# EAGLE design led_board (EAGLE 9.6.2)
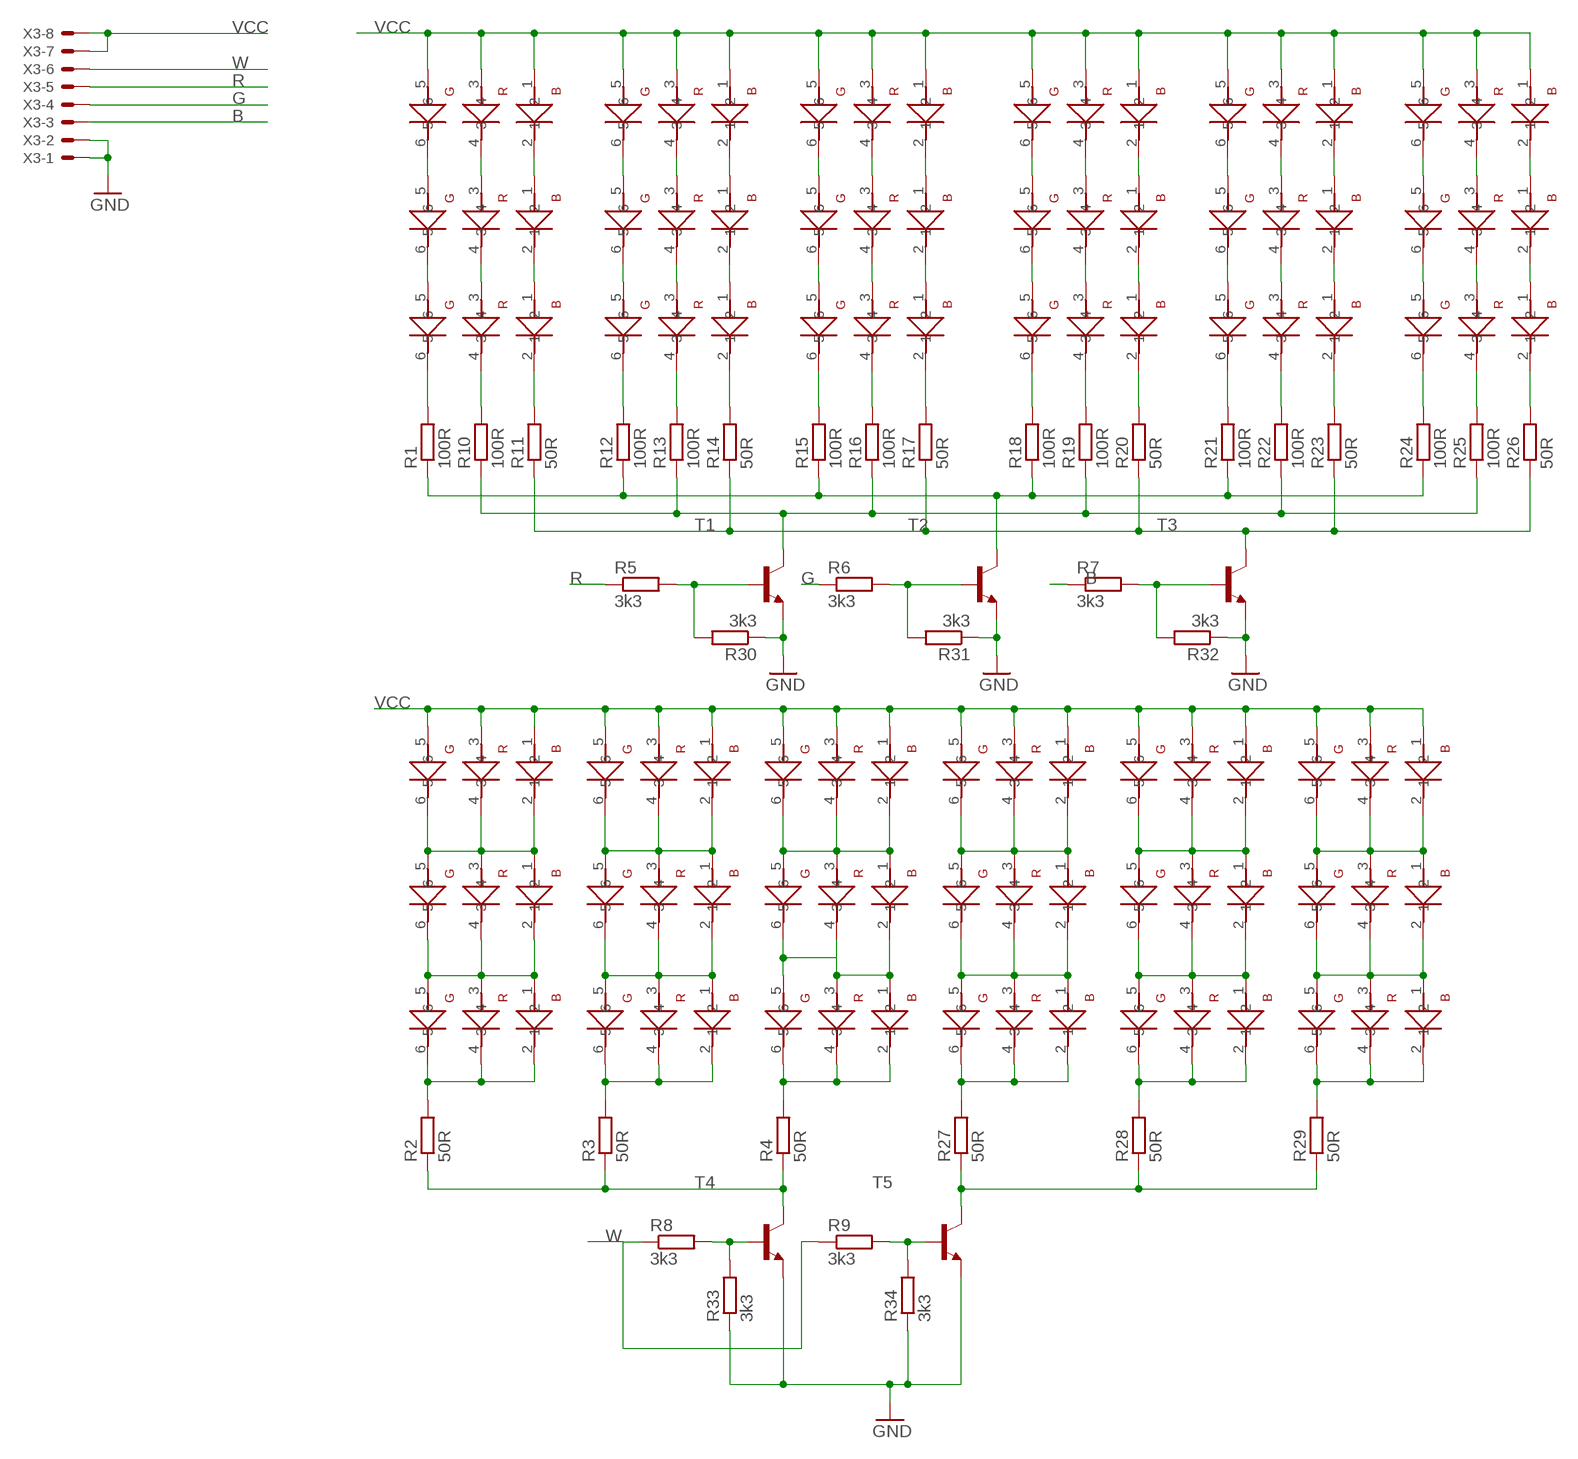
[diagram p0: schematic, sheet 1]

## Parts
R1  100R  R-EU_M1206  [M1206]
R2  50R  R-EU_M1206  [M1206]
R3  50R  R-EU_M1206  [M1206]
R4  50R  R-EU_M1206  [M1206]
R5  3k3  R-EU_M1206  [M1206]
R6  3k3  R-EU_M1206  [M1206]
R7  3k3  R-EU_M1206  [M1206]
R8  3k3  R-EU_M1206  [M1206]
R9  3k3  R-EU_M1206  [M1206]
R10  100R  R-EU_M1206  [M1206]
R11  50R  R-EU_M1206  [M1206]
R12  100R  R-EU_M1206  [M1206]
R13  100R  R-EU_M1206  [M1206]
R14  50R  R-EU_M1206  [M1206]
R15  100R  R-EU_M1206  [M1206]
R16  100R  R-EU_M1206  [M1206]
R17  50R  R-EU_M1206  [M1206]
R18  100R  R-EU_M1206  [M1206]
R19  100R  R-EU_M1206  [M1206]
R20  50R  R-EU_M1206  [M1206]
R21  100R  R-EU_M1206  [M1206]
R22  100R  R-EU_M1206  [M1206]
R23  50R  R-EU_M1206  [M1206]
R24  100R  R-EU_M1206  [M1206]
R25  100R  R-EU_M1206  [M1206]
R26  50R  R-EU_M1206  [M1206]
R27  50R  R-EU_M1206  [M1206]
R28  50R  R-EU_M1206  [M1206]
R29  50R  R-EU_M1206  [M1206]
R30  3k3  R-EU_M1206  [M1206]
R31  3k3  R-EU_M1206  [M1206]
R32  3k3  R-EU_M1206  [M1206]
R33  3k3  R-EU_M1206  [M1206]
R34  3k3  R-EU_M1206  [M1206]
T1  -NPN-SOT223  [SOT223]
T2  -NPN-SOT223  [SOT223]
T3  -NPN-SOT223  [SOT223]
T4  -NPN-SOT223  [SOT223]
T5  -NPN-SOT223  [SOT223]
U$1  5050_LED  [5050_LED]
U$2  5050_LED  [5050_LED]
U$3  5050_LED  [5050_LED]
U$4  5050_LED  [5050_LED]
U$5  5050_LED  [5050_LED]
U$6  5050_LED  [5050_LED]
U$7  5050_LED  [5050_LED]
U$8  5050_LED  [5050_LED]
U$9  5050_LED  [5050_LED]
U$10  5050_LED  [5050_LED]
U$11  5050_LED  [5050_LED]
U$12  5050_LED  [5050_LED]
U$13  5050_LED  [5050_LED]
U$14  5050_LED  [5050_LED]
U$15  5050_LED  [5050_LED]
U$16  5050_LED  [5050_LED]
U$17  5050_LED  [5050_LED]
U$18  5050_LED  [5050_LED]
U$19  5050_LED  [5050_LED]
U$20  5050_LED  [5050_LED]
U$21  5050_LED  [5050_LED]
U$22  5050_LED  [5050_LED]
U$23  5050_LED  [5050_LED]
U$24  5050_LED  [5050_LED]
U$25  5050_LED  [5050_LED]
U$26  5050_LED  [5050_LED]
U$27  5050_LED  [5050_LED]
U$28  5050_LED  [5050_LED]
U$29  5050_LED  [5050_LED]
U$30  5050_LED  [5050_LED]
U$31  5050_LED  [5050_LED]
U$32  5050_LED  [5050_LED]
U$33  5050_LED  [5050_LED]
U$34  5050_LED  [5050_LED]
U$35  5050_LED  [5050_LED]
U$38  5050_LED  [5050_LED]
X3  KK-156-8  [KK-156-8]

## Nets
B: R7.1 X3.3
G: R6.1 X3.4
GND: R30.1 R31.1 R32.1 R33.1 R34.1 T1.3(E) T2.3(E) T3.3(E) T4.3(E) T5.3(E) X3.1 X3.2
N$1: R6.2 R31.2 T2.1(B)
N$3: R7.2 R32.2 T3.1(B)
N$4: R11.1 R14.1 R17.1 R20.1 R23.1 R26.1 T3.4(C)
N$5: U$34.2 U$38.1
N$6: R1.1 R12.1 R15.1 R18.1 R21.1 R24.1 T2.4(C)
N$7: U$34.4 U$38.3
N$8: R10.1 R13.1 R16.1 R19.1 R22.1 R25.1 T1.4(C)
N$9: U$34.6 U$38.5
N$10: U$1.1 U$38.2
N$12: R5.2 R30.2 T1.1(B)
N$14: R8.2 R33.2 T4.1(B)
N$15: R9.2 R34.2 T5.1(B)
N$17: U$1.3 U$38.4
N$18: U$1.5 U$38.6
N$19: U$2.2 U$3.1
N$20: U$2.4 U$3.3
N$21: U$2.6 U$3.5
N$22: U$3.2 U$4.1
N$23: U$3.4 U$4.3
N$24: U$3.6 U$4.5
N$25: U$5.2 U$6.1
N$26: U$5.4 U$6.3
N$27: U$5.6 U$6.5
N$28: U$6.2 U$7.1
N$29: U$6.4 U$7.3
N$30: U$6.6 U$7.5
N$31: U$8.2 U$9.1
N$32: U$8.4 U$9.3
N$33: U$8.6 U$9.5
N$34: U$9.2 U$10.1
N$35: U$9.4 U$10.3
N$36: U$9.6 U$10.5
N$37: U$11.2 U$12.1
N$38: U$11.4 U$12.3
N$39: U$11.6 U$12.5
N$40: U$12.2 U$13.1
N$41: U$12.4 U$13.3
N$42: U$12.6 U$13.5
N$43: U$14.2 U$15.1
N$44: U$14.4 U$15.3
N$45: U$14.6 U$15.5
N$46: U$15.2 U$16.1
N$47: U$15.4 U$16.3
N$48: U$15.6 U$16.5
N$50: R1.2 U$1.6
N$51: R10.2 U$1.4
N$52: R11.2 U$1.2
N$53: R12.2 U$4.6
N$54: R13.2 U$4.4
N$55: R15.2 U$7.6
N$56: R16.2 U$7.4
N$57: R17.2 U$7.2
N$58: R18.2 U$10.6
N$59: R19.2 U$10.4
N$60: R21.2 U$13.6
N$61: R22.2 U$13.4
N$62: R23.2 U$13.2
N$63: R24.2 U$16.6
N$64: R26.2 U$16.2
N$65: R25.2 U$16.4
N$66: R20.2 U$10.2
N$67: R14.2 U$4.2
N$68: U$17.2 U$17.4 U$17.6 U$23.1 U$23.3 U$23.5
N$70: U$18.2 U$18.4 U$18.6 U$24.1 U$24.3 U$24.5
N$75: U$19.2 U$19.4 U$19.6 U$25.1 U$25.3 U$25.5
N$78: U$20.2 U$20.4 U$20.6 U$26.1 U$26.3 U$26.5
N$79: U$21.2 U$21.4 U$21.6 U$27.1 U$27.3 U$27.5
N$84: U$22.2 U$22.4 U$22.6 U$28.1 U$28.3 U$28.5
N$87: U$23.2 U$23.4 U$23.6 U$29.1 U$29.3 U$29.5
N$90: U$24.2 U$24.4 U$24.6 U$30.1 U$30.3 U$30.5
N$91: U$25.2 U$25.4 U$25.6 U$31.1 U$31.3 U$31.5
N$94: U$26.2 U$26.4 U$26.6 U$32.1 U$32.3 U$32.5
N$99: U$27.2 U$27.4 U$27.6 U$33.1 U$33.3 U$33.5
N$100: U$28.2 U$28.4 U$28.6 U$35.1 U$35.3 U$35.5
N$104: R2.2 U$29.2 U$29.4 U$29.6
N$105: R29.2 U$35.2 U$35.4 U$35.6
N$106: R28.2 U$33.2 U$33.4 U$33.6
N$107: R27.2 U$32.2 U$32.4 U$32.6
N$108: R4.2 U$31.2 U$31.4 U$31.6
N$109: R3.2 U$30.2 U$30.4 U$30.6
N$111: R27.1 R28.1 R29.1 T5.4(C)
N$112: R2.1 R3.1 R4.1 T4.4(C)
R: R5.1 X3.5
VCC: U$2.1 U$2.3 U$2.5 U$5.1 U$5.3 U$5.5 U$8.1 U$8.3 U$8.5 U$11.1 U$11.3 U$11.5 U$14.1 U$14.3 U$14.5 U$17.1 U$17.3 U$17.5 U$18.1 U$18.3 U$18.5 U$19.1 U$19.3 U$19.5 U$20.1 U$20.3 U$20.5 U$21.1 U$21.3 U$21.5 U$22.1 U$22.3 U$22.5 U$34.1 U$34.3 U$34.5 X3.7 X3.8
W: R8.1 R9.1 X3.6

## Library data of the parts
R1-R34 = rcl:R-EU_: RESISTOR, European symbol; SPICEPREFIX: R
T1-T5 = transistor-neu-to92:*-NPN-: NPN Transistror
U$1-U$35 U$38 = leds:5050_LED
X3 = con-molex:KK-156-8: KK 156 HEADER Source: http://www.molex.com/pdm_docs/sd/026604100_sd.pdf; MF: MOLEX; OC_FARNELL: unknown; OC_NEWARK: unknown

## Board
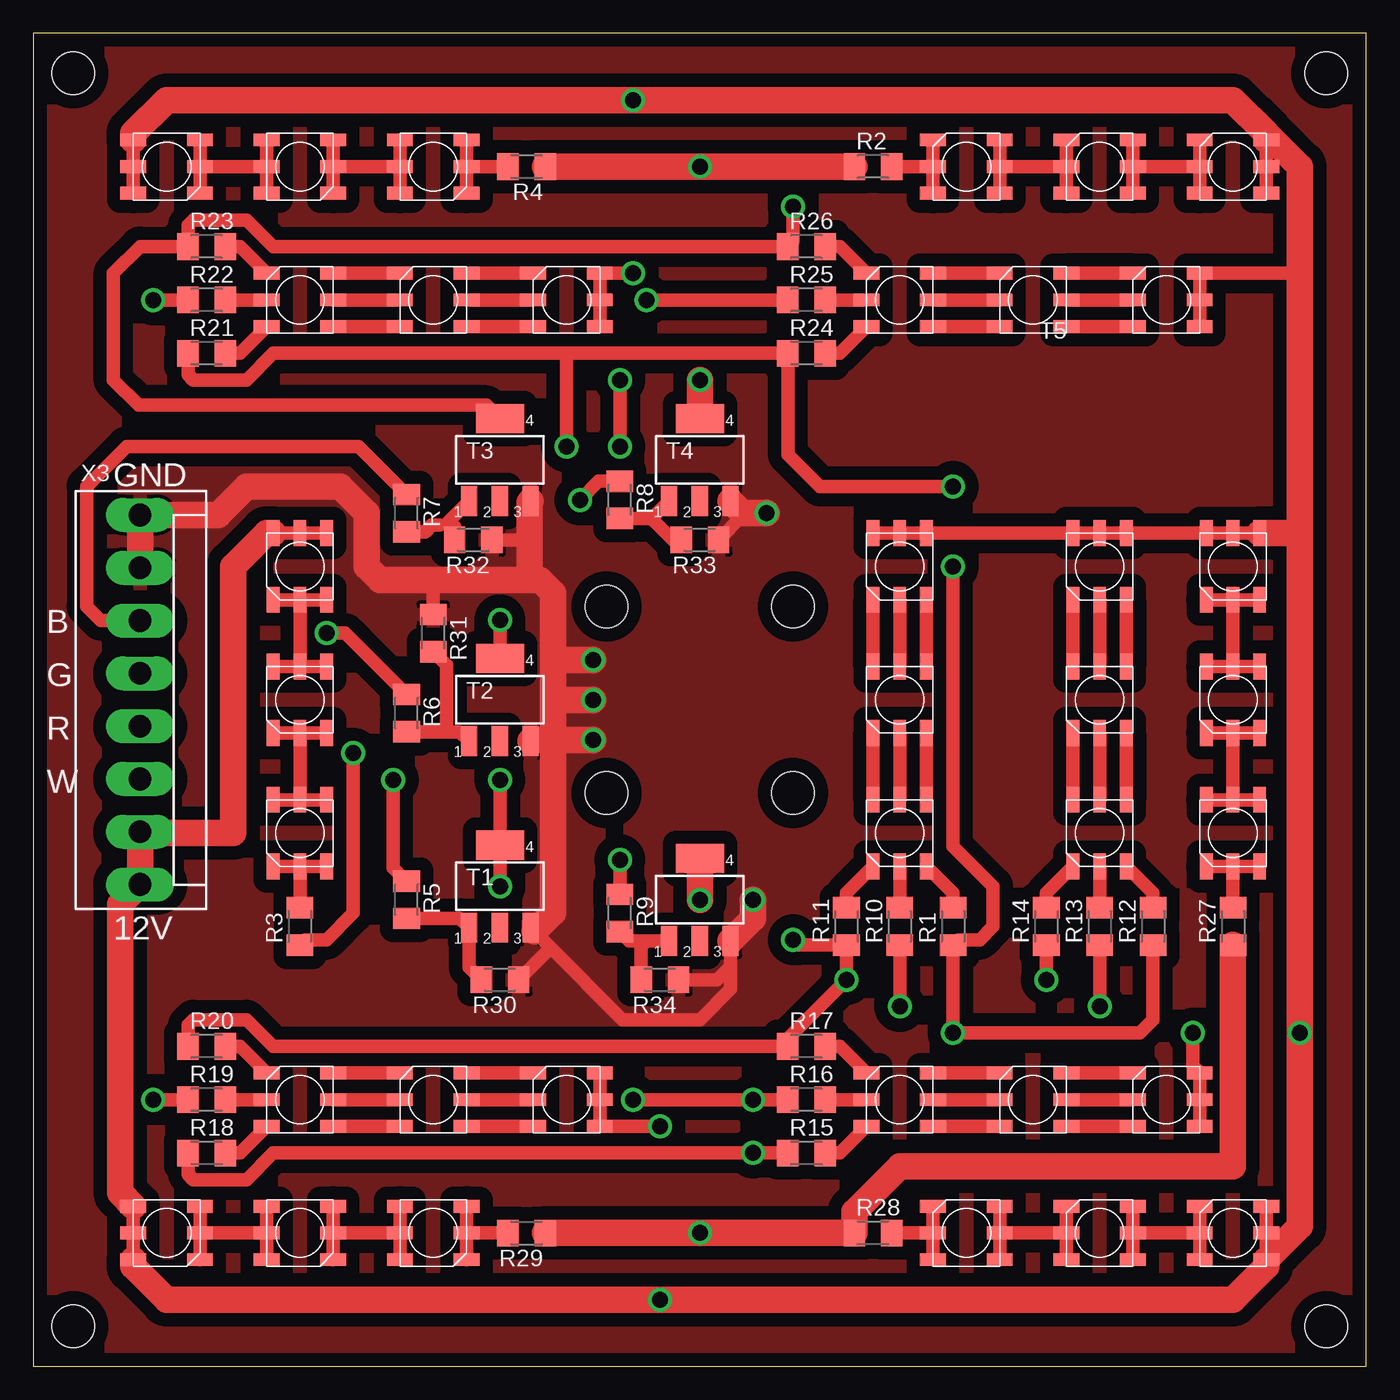
[diagram p1: board, top side]
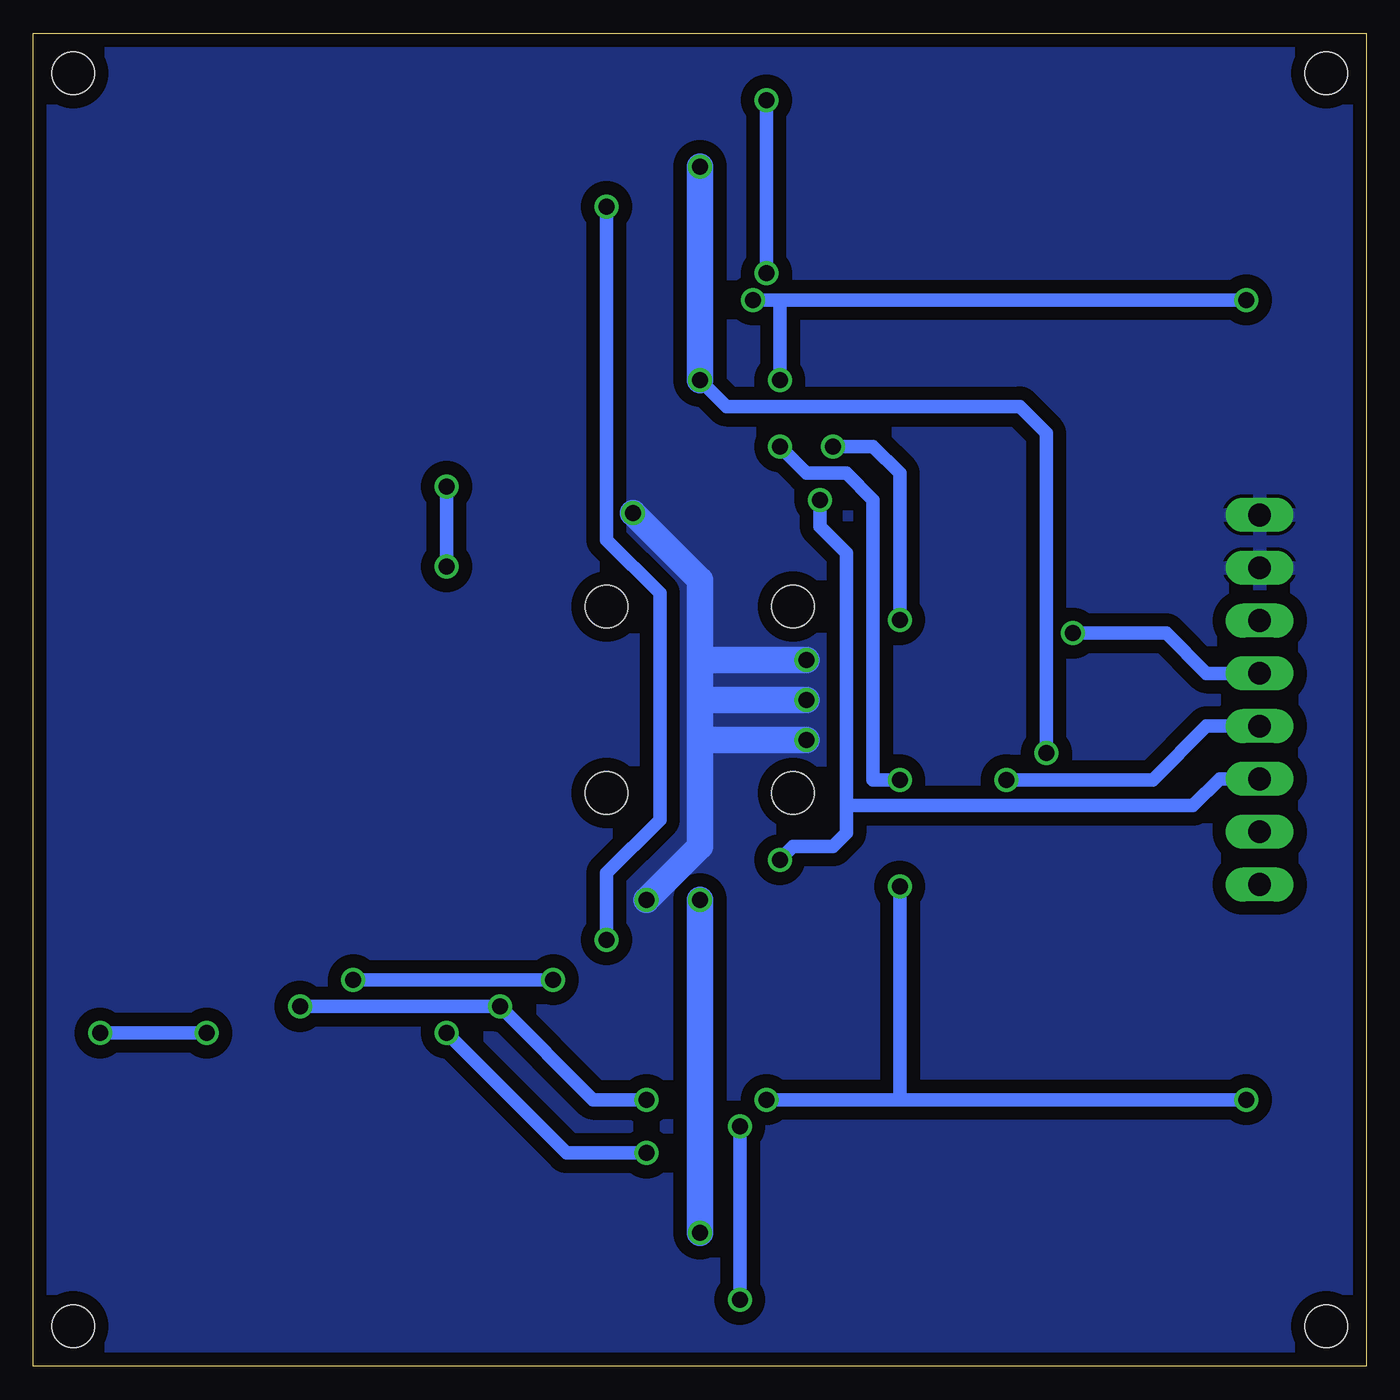
[diagram p2: board, bottom side, seen from below]

Size 100 x 100 mm. Coordinates in mm from the lower left corner, seen from the top.
Outline: 0,0 100,0 100,100 0,100 0,0
Copper layers (1*16): Top 0.035mm / dielectric 1.5mm / Bottom 0.035mm
Design rules "default": minimum track width 6mil, minimum drill 0.35mm, track to track 6mil, track to pad 6mil, pad to pad 6mil, via to via 6mil, smd to smd 6mil, copper to edge 40mil, drill to drill 6mil, minimum pad ring 10mil, minimum via ring 8mil, stop-mask expansion 4mil, vias tented up to drill 0mil, thermal gap 10mil
Holes 3.2 mm at 3,97 3,3 97,97 97,3 43,57 43,43 57,43 57,57

### Footprints (pad centres in the part's own frame; a part is rotated, then mirrored left to right if it is on the bottom)
M1206 = smd 1.6 x 2: 1 -1.4,0; 2 1.4,0
SOT223 = smd 1.219 x 2.235: 1 -2.311,-3.099; 2 0,-3.099; 3 2.311,-3.099 | smd 3.6 x 2.2: 4 0,3.099
5050_LED = smd 1.93 x 0.965: 1 2.5,2; 2 -2.5,2; 3 2.5,0; 4 -2.5,0; 5 2.5,-2; 6 -2.5,-2
KK-156-8 = drill 1.7 pad 2.184 long: 1 -13.86,0; 2 -9.9,0; 3 -5.94,0; 4 -1.98,0; 5 1.98,0; 6 5.94,0; 7 9.9,0; 8 13.86,0

### Placement (x,y rotation side)
R1  69,33 90 top
R2  63,90 0 top
R3  20,33 90 top
R4  37,90 180 top
R5  28,35 270 top
R6  28,49 270 top
R7  28,64 270 top
R8  44,65 270 top
R9  44,34 270 top
R10  65,33 90 top
R11  61,33 90 top
R12  84,33 90 top
R13  80,33 90 top
R14  76,33 90 top
R15  58,16 0 top
R16  58,20 0 top
R17  58,24 0 top
R18  13,16 0 top
R19  13,20 0 top
R20  13,24 0 top
R21  13,76 0 top
R22  13,80 0 top
R23  13,84 0 top
R24  58,76 0 top
R25  58,80 0 top
R26  58,84 0 top
R27  90,33 90 top
R28  63,10 0 top
R29  37,10 180 top
R30  35,29 180 top
R31  30,55 270 top
R32  33,62 180 top
R33  50,62 180 top
R34  47,29 180 top
T1  35,36 0 top
T2  35,50 0 top
T3  35,68 0 top
T4  50,68 0 top
T5  50,35 0 top
U$1  65,40 90 top
U$2  80,60 90 top
U$3  80,50 90 top
U$4  80,40 90 top
U$5  85,20 0 top
U$6  75,20 0 top
U$7  65,20 0 top
U$8  40,20 0 top
U$9  30,20 0 top
U$10  20,20 0 top
U$11  40,80 0 top
U$12  30,80 0 top
U$13  20,80 0 top
U$14  85,80 0 top
U$15  75,80 0 top
U$16  65,80 0 top
U$17  90,90 0 top
U$18  20,60 90 top
U$19  10,90 180 top
U$20  90,60 90 top
U$21  90,10 0 top
U$22  10,10 180 top
U$23  80,90 0 top
U$24  20,50 90 top
U$25  20,90 180 top
U$26  90,50 90 top
U$27  80,10 0 top
U$28  20,10 180 top
U$29  70,90 0 top
U$30  20,40 90 top
U$31  30,90 180 top
U$32  90,40 90 top
U$33  70,10 0 top
U$34  65,60 90 top
U$35  30,10 180 top
U$38  65,50 90 top
X3  8,50 270 top

### Tracks (layer width: path | path; a pad name or v marks a point on that pad's centre or on a via)
B
  Top 1: R7.1 24.4,69 7,69 4,66 4,57 5.06,55.94 X3.3
G  (via drill 1.2)
  Top 1: R6.1 23.4,55 v22,55
  Bottom 1: v22,55 15,55 11.98,51.98 X3.4
GND  (via drill 1.2)
  Top 1: T5.3 52.31,30 | 52.31,30 52.31,28.31 50,26 44.21,26 38.61,31.61 | 38.61,31.61 37.61,32.61 T1.3 | R34.1 51.31,29 52.31,30 | R30.1 38.61,31.21 38.61,31.61 | R31.1 30,59 | R33.1 53.21,63.81 53.21,64 | R32.1 37.21,62
  Top 2: X3.2 X3.1 13.86,63.86 16,66 23,66 25,64 25,60 26,59 30,59 37.21,59 | 37.21,59 38,59 39,58 39,53 | 37.61,32.61 39,34 39,47 | 39,47 39,50 | 39,50 39,53 | T2.3 37.41,47 39,47 | v55,64 53.21,64 T4.3 | v54,35 54,33.59 T5.3 | T3.3 37.21,64.8 37.21,62 37.21,59 | 39,53 v42,53 | v42,47 39,47 | v42,50 39,50
  Bottom 2: v55,64 50,59 50,53 | 50,50 50,47 | 50,47 50,39 v54,35 | 50,53 v42,53 | 50,47 v42,47 | 50,50 v42,50 | 50,53 50,50
  pour Top (isolate 1): 0,100 100,100 100,0 0,0
  pour Bottom (isolate 1): 0,100 100,100 100,0 0,0
N$1
  Top 1: R6.2 31,47.6 | 31,47.6 31.99,47.6 T2.1 | R31.2 31,52.6 31,47.6
N$3
  Top 1: R7.2 29.39,62.6 29.89,63.11 30.49,63.11 | T3.1 31.19,63.41 31.6,63 R32.2
N$4  (via drill 1.2)
  Top 1: R20.1 11.6,25.6 12,26 16,26 18,24 R17.1 56.6,24.6 v61,29 R11.1 57.4,31.6 v57,32 | R14.1 v76,29 | T3.4 34,72.1 7.9,72.1 6,74 6,82 8,84 R23.1 11.6,85.6 12,86 16,86 18,84 R26.1 57,84.4 v57,87
  Bottom 1: v76,29 v61,29 | v57,32 57,37 53,41 53,58 57,62 v57,87
N$5
  Top 1: U$38.1 U$34.2
N$6  (via drill 1.2)
  Top 1: R21.1 11.6,74.4 12,74 16,74 18,76 40,76 | 40,76 R24.1 56.6,68.4 59,66 v69,66 | R18.1 11.6,14.4 12,14 16,14 18,16 v54,16 R15.1 | R12.1 84,26 83,25 v69,25 R1.1 69.4,32 71,32 72,33 72,36 69,39 v69,60 | T2.4 v35,56 | v40,69 40,76
  Bottom 1: v69,25 60,16 v54,16 | v35,56 35,67 37,69 v40,69 | v69,60 v69,66
N$7
  Top 1: U$34.4 U$38.3
N$8  (via drill 1.2)
  Top 1: R22.1 v9,80 | v46,80 R25.1 | v45,20 v54,20 R16.1 | R19.1 v9,20 | v35,36 T1.4 v35,44 | R10.1 v65,27 | R13.1 v80,27 | v44,74 v44,69
  Bottom 1: v9,80 44,80 | 44,80 v46,80 | v9,20 35,20 | 35,20 v45,20 | v35,36 35,20 | v54,20 58,20 v65,27 v80,27 | 44,80 v44,74 | v44,69 42,67 39,67 37,65 37,44 v35,44
N$9
  Top 1: U$34.6 U$38.5
N$10
  Top 1: U$1.1 U$38.2
N$12
  Top 1: R5.2 31.99,33.6 T1.1 32.69,29.91 R30.2
N$14
  Top 1: R8.2 46.39,63.6 | 46.39,63.6 T4.1 | R33.2 47.99,62 46.39,63.6
N$15
  Top 1: R9.2 44.7,31.9 46,31.9 | 46,31.9 T5.1 | R34.2 45.6,31.5 46,31.9
N$17
  Top 1: U$38.4 U$1.3
N$18
  Top 1: U$1.5 U$38.6
N$19
  Top 1: U$2.2 U$3.1
N$20
  Top 1: U$2.4 U$3.3
N$21
  Top 1: U$2.6 U$3.5
N$22
  Top 1: U$3.2 U$4.1
N$23
  Top 1: U$4.3 U$3.4
N$24
  Top 1: U$3.6 U$4.5
N$25
  Top 1: U$5.2 U$6.1
N$26
  Top 1: U$5.4 U$6.3
N$27
  Top 1: U$6.5 U$5.6
N$28
  Top 1: U$7.1 U$6.2
N$29
  Top 1: U$6.4 U$7.3
N$30
  Top 1: U$6.6 U$7.5
N$31
  Top 1: U$8.2 U$9.1
N$32
  Top 1: U$8.4 U$9.3
N$33
  Top 1: U$9.5 U$8.6
N$34
  Top 1: U$10.1 U$9.2
N$35
  Top 1: U$9.4 U$10.3
N$36
  Top 1: U$10.5 U$9.6
N$37
  Top 1: U$11.2 U$12.1
N$38
  Top 1: U$12.3 U$11.4
N$39
  Top 1: U$11.6 U$12.5
N$40
  Top 1: U$12.2 U$13.1
N$41
  Top 1: U$13.3 U$12.4
N$42
  Top 1: U$13.5 U$12.6
N$43
  Top 1: U$14.2 U$15.1
N$44
  Top 1: U$14.4 U$15.3
N$45
  Top 1: U$14.6 U$15.5
N$46
  Top 1: U$16.1 U$15.2
N$47
  Top 1: U$15.4 U$16.3
N$48
  Top 1: U$15.6 U$16.5
N$50
  Top 1: U$1.6 69,35.5 R1.2
N$51
  Top 1: R10.2 U$1.4
N$52
  Top 1: R11.2 61,35.5 U$1.2
N$53
  Top 1: U$4.6 84,35.5 R12.2
N$54
  Top 1: U$4.4 R13.2
N$55
  Top 1: U$7.6 60.5,16 R15.2
N$56
  Top 1: R16.2 U$7.4
N$57
  Top 1: R17.2 60.5,24 U$7.2
N$58
  Top 1: U$10.6 15.5,16 R18.2
N$59
  Top 1: R19.2 U$10.4
N$60
  Top 1: U$13.6 15.5,76 R21.2
N$61
  Top 1: U$13.4 R22.2
N$62
  Top 1: R23.2 15.5,84 U$13.2
N$63
  Top 1: U$16.6 60.5,76 R24.2
N$64
  Top 1: U$16.2 60.5,84 R26.2
N$65
  Top 1: U$16.4 R25.2
N$66
  Top 1: U$10.2 15.5,24 R20.2
N$67
  Top 1: R14.2 76,35.5 U$4.2
N$68
  Top 1: U$23.1 U$23.3 | U$23.3 U$23.5 | U$17.6 U$17.4 | U$17.2 U$17.4 | U$17.4 U$23.3
N$70
  Top 1: U$18.2 U$18.4 | U$18.4 U$18.6 | U$24.5 U$24.3 | U$24.3 U$24.1 | U$18.4 U$24.3
N$75
  Top 1: U$25.1 U$25.3 | U$25.3 U$25.5 | U$19.6 U$19.4 | U$19.4 U$19.2 | U$19.4 U$25.3
N$78
  Top 1: U$20.2 U$20.4 | U$20.4 U$20.6 | U$26.5 U$26.3 | U$26.3 U$26.1 | U$20.4 U$26.3
N$79
  Top 1: U$21.2 U$21.4 | U$21.4 U$21.6 | U$27.1 U$27.3 | U$27.3 U$27.5 | U$21.4 U$27.3
N$84
  Top 1: U$28.5 U$28.3 | U$28.3 U$28.1 | U$22.2 U$22.4 | U$22.4 U$22.6 | U$22.4 U$28.3
N$87
  Top 1: U$29.1 U$29.3 | U$29.3 U$29.5 | U$23.6 U$23.4 | U$23.4 U$23.2 | U$23.4 U$29.3
N$90
  Top 1: U$30.1 U$30.3 | U$30.3 U$30.5 | U$24.6 U$24.4 | U$24.4 U$24.2 | U$24.4 U$30.3
N$91
  Top 1: U$31.1 U$31.3 | U$31.3 U$31.5 | U$25.6 U$25.4 | U$25.4 U$25.2 | U$31.3 U$25.4
N$94
  Top 1: U$32.1 U$32.3 | U$32.3 U$32.5 | U$26.4 U$32.3 | U$26.2 U$26.4 | U$26.4 U$26.6
N$99
  Top 1: U$33.5 U$33.3 | U$33.3 U$33.1 | U$27.4 U$33.3 | U$27.2 U$27.4 | U$27.4 U$27.6
N$100
  Top 1: U$35.5 U$35.3 | U$35.3 U$35.1 | U$28.2 U$28.4 | U$28.4 U$28.6 | U$28.4 U$35.3
N$104
  Top 1: U$29.2 U$29.4 | U$29.4 U$29.6 | U$29.4 R2.2
N$105
  Top 1: U$35.2 U$35.4 | U$35.4 U$35.6 | U$35.4 R29.2
N$106
  Top 1: U$33.2 U$33.4 | U$33.4 U$33.6 | U$33.4 R28.2
N$107
  Top 1: U$32.2 U$32.4 | U$32.4 U$32.6 | R27.2 U$32.4
N$108
  Top 1: U$31.2 U$31.4 | U$31.4 U$31.6 | R4.2 U$31.4
N$109
  Top 1: U$30.2 U$30.4 | U$30.4 U$30.6 | U$30.4 R3.2
N$111  (via drill 1.2)
  Top 2: R29.1 v50,10 R28.1 61.6,11.6 65,15 90,15 R27.1 | T5.4 v50,35
  Bottom 2: v50,35 v50,10
N$112  (via drill 1.2)
  Top 1: R3.1 20.4,32 22,32 24,34 v24,46
  Top 2: R4.1 v50,90 R2.1 | T4.4 v50,74
  Bottom 1: v24,46 24,70 26,72 48,72 v50,74
  Bottom 2: v50,74 v50,90
R  (via drill 1.2)
  Top 1: R5.1 27,37.4 v27,44
  Bottom 1: v27,44 16,44 11.98,48.02 X3.5
VCC  (via drill 1.2)
  Top 1: U$8.1 U$8.3 U$8.5 v47,18 | U$5.5 U$5.3 U$5.1 87,22.5 v87,25 | U$34.1 U$34.3 U$34.5 U$2.1 U$2.3 U$2.5 U$20.1 U$20.3 U$20.5 | U$11.5 U$11.3 U$11.1 v45,82 | U$14.5 U$14.3 U$14.1 95,82 | U$17.5 U$17.3 U$17.1 | U$18.5 U$18.3 U$18.1 | U$19.5 U$19.3 U$19.1 | U$22.5 U$22.3 U$22.1 | U$21.1 U$21.3 U$21.5
  Top 2: 92.5,92.5 90,95 v45,95 10,95 7.5,92.5 U$19.5 | 92.5,92.5 U$17.1 | 92.5,92.5 95,90 95,82 95,63 | U$18.1 17.5,62.5 15,60 15,40 8.1,40 X3.7 X3.8 6.5,34.64 6.5,13 U$22.5 | U$22.1 7.5,7.5 10,5 v47,5 90,5 92.5,7.5 U$21.5 95,10.5 v95,25 95,63 | U$20.5 94.5,62.5 95,63
  Bottom 1: v45,82 v45,95 | v47,18 v47,5 | v87,25 v95,25
W  (via drill 1.2)
  Top 1: v44,38 R9.1 | R8.1 42.4,66.4 v41,65
  Bottom 1: X3.6 11,44.06 13,42.06 39,42.06 | 39,42.06 39,40 40,39 43,39 v44,38 | v41,65 41,63 39,61 39,42.06

### Text on the board
tPlace: GND | B | G | R | W | 12V